# EAGLE schematic main (EAGLE 6.5.0)
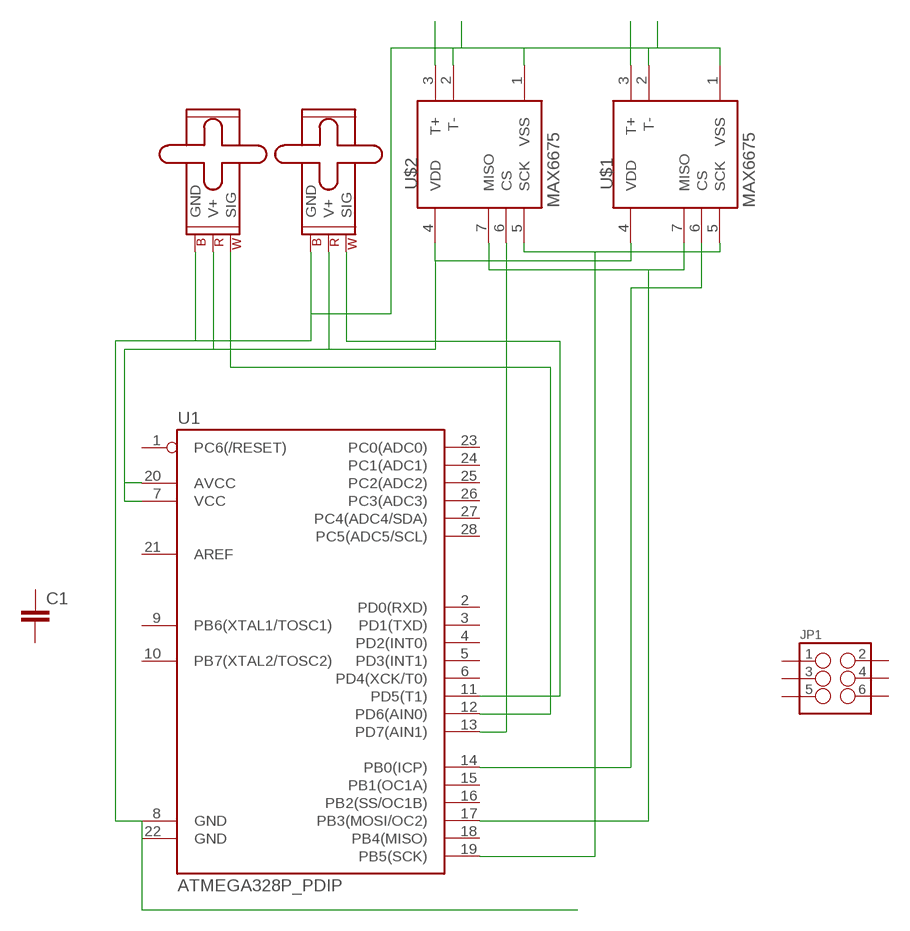
[diagram p0: schematic, sheet 1]

## Parts
C1  0.1UF-50V-20%(PTH)KIT-EZ  [CAP-PTH-SMALL-KIT]
JP1  M03X2  [2X3-SHROUDED]
M1  SMALL_SERVO  [1X03]
M2  SMALL_SERVO  [1X03]
U1  ATMEGA328P_PDIP  [DIL28-3]
U$1  MAX6675  [SO08-MAX6675]
U$2  MAX6675  [SO08-MAX6675]

## Nets
N$1: U$1.3(T+)
N$2: U$2.3(T+)
N$3: M1.2(V+) M2.2(V+) U1.7(VCC) U1.20(AVCC) U$1.4(VDD) U$2.4(VDD)
N$13: M1.3(GND) M2.3(GND) U1.8(GND) U1.22(GND) U$1.1(VSS) U$1.2(T-) U$2.1(VSS) U$2.2(T-)
N$21: U1.17(PB3(MOSI/OC2)) U$1.7(MISO) U$2.7(MISO)
N$22: U1.19(PB5(SCK)) U$1.5(SCK) U$2.5(SCK)
N$24: M2.1(SIG) U1.11(PD5(T1))
N$25: U1.13(PD7(AIN1)) U$2.6(CS)
N$26: U1.14(PB0(ICP)) U$1.6(CS)
N$27: M1.1(SIG) U1.12(PD6(AIN0))
Unconnected: C1.1 C1.2 JP1.1 JP1.2 JP1.3 JP1.4 JP1.5 JP1.6 U1.1(PC6(/RESET)) U1.2(PD0(RXD)) U1.3(PD1(TXD)) U1.4(PD2(INT0)) U1.5(PD3(INT1)) U1.6(PD4(XCK/T0)) U1.9(PB6(XTAL1/TOSC1)) U1.10(PB7(XTAL2/TOSC2)) U1.15(PB1(OC1A)) U1.16(PB2(SS/OC1B)) U1.18(PB4(MISO)) U1.21(AREF) U1.23(PC0(ADC0)) U1.24(PC1(ADC1)) U1.25(PC2(ADC2)) U1.26(PC3(ADC3)) U1.27(PC4(ADC4/SDA)) U1.28(PC5(ADC5/SCL))

## Library data of the parts
C1 = SparkFun-Capacitors:0.1UF-50V-20%(PTH): CAP-08370; PROD_ID: CAP-08370
JP1 = SparkFun-Connectors:M03X2: 2x3 .1" header. Shrouded, with keying- CONN-10681 SMT- CONN-11415 Pogo pins- HW-11044; PROD_ID: CONN-10681
M1 M2 = SparkFun-Electromechanical:SMALL_SERVO: Small servo motor This is the small servo used in the SIK. SKU: ROB-09065
U1 = SparkFun-DigitalIC:ATMEGA328P_PDIP: uC used in the Arduino 32kb flash, 1k EEPROM, 2k SRAM This is the through-hole version of this chip.
U$1 U$2 = SparkFun-AnalogIC:MAX6675: K-type thermocouple ADC, SPI output